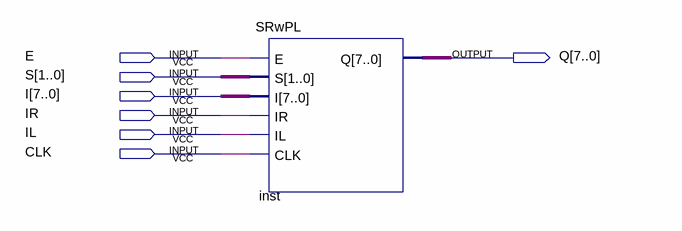
[diagram p0: schematic sheet]
// Quartus schematic TOP.bdf as structural Verilog: 1 symbols, 7 pins
module TOP (
  input  E,
  input  [1:0] S,
  input  [7:0] I,
  input  IR,
  input  IL,
  input  CLK,
  output [7:0] Q
);

  SRwPL inst (.E(E), .S(S), .I(I), .IR(IR), .IL(IL), .CLK(CLK), .Q(Q));
endmodule
